# Altium schematic sheet LoRa_Node.SchDoc
size A3
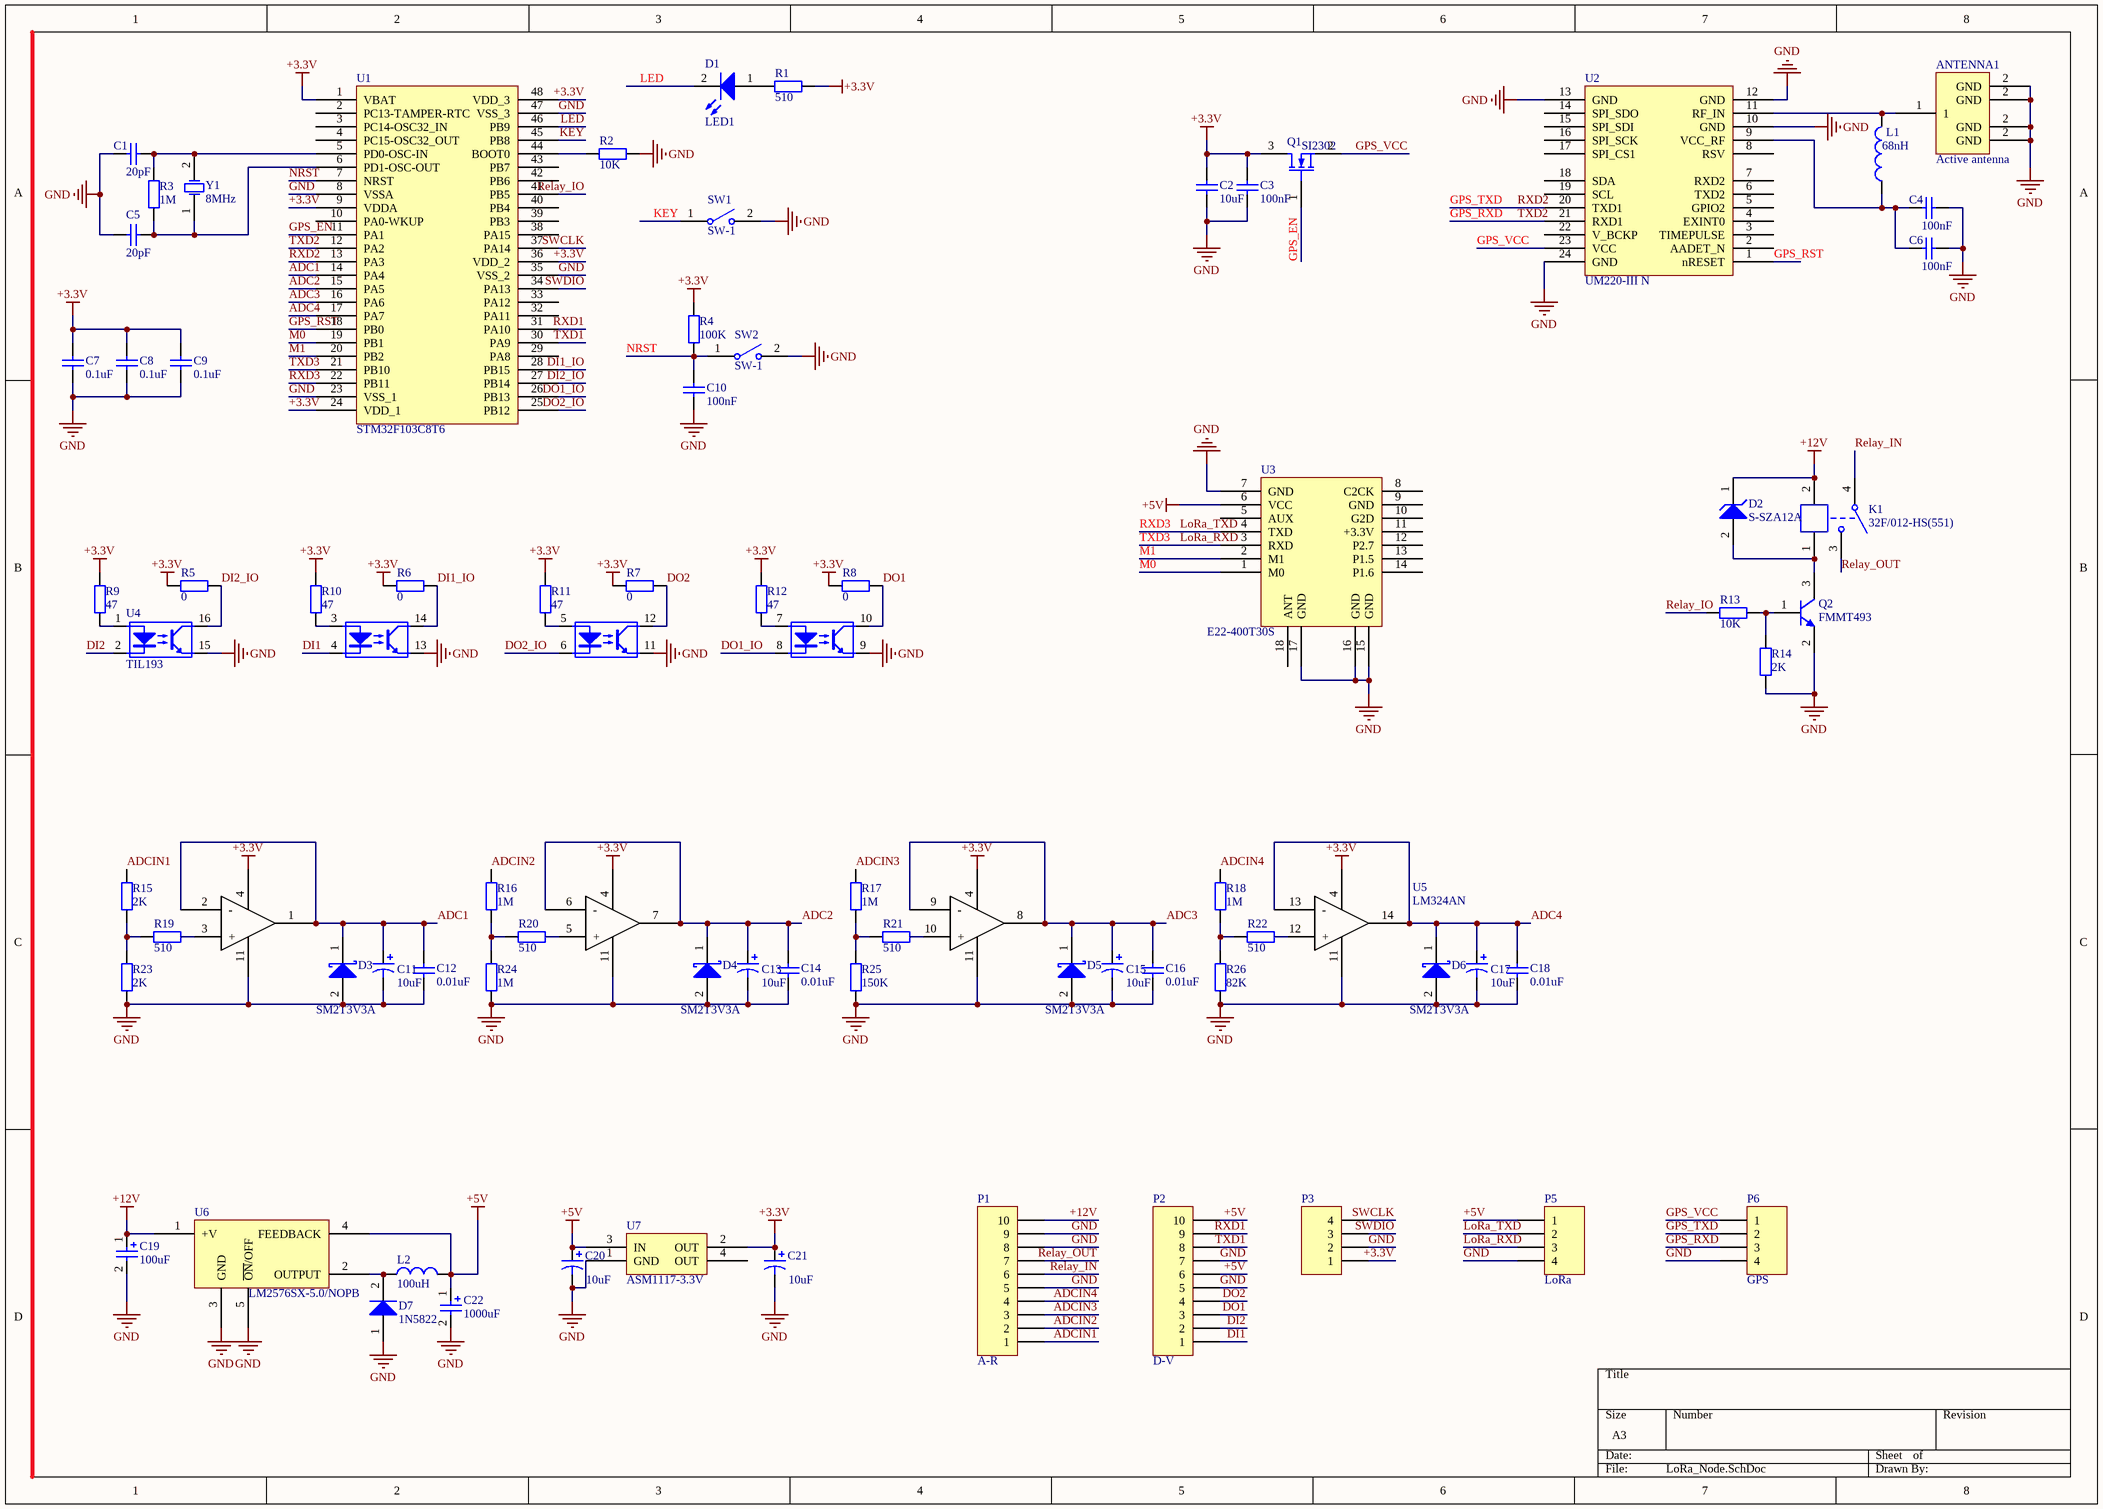
[diagram p0: LoRa_Node.SchDoc]

## Parts
ANTENNA1  Active antenna  [SMA-W]
C1  value 20pF  [0603C]  (hidden comment: Cap8)
C2  value 10uF  [0603C]  (hidden comment: Cap15)
C3  value 100nF  [0603C]  (hidden comment: Cap16)
C4  value 100nF  [0603C]  (hidden comment: Cap17)
C5  value 20pF  [0603C]  (hidden comment: Cap9)
C6  value 100nF  [0603C]  (hidden comment: Cap18)
C7  value 0.1uF  [0603C]  (hidden comment: Cap11)
C8  value 0.1uF  [0603C]  (hidden comment: Cap12)
C9  value 0.1uF  [0603C]  (hidden comment: Cap13)
C10  value 100nF  [0603C]  (hidden comment: Cap10)
C11  value 10uF  [0603C]
C12  value 0.01uF  [0603C]  (hidden comment: Cap)
C13  value 10uF  [0603C]
C14  value 0.01uF  [0603C]  (hidden comment: Cap)
C15  value 10uF  [0603C]
C16  value 0.01uF  [0603C]  (hidden comment: Cap)
C17  value 10uF  [0603C]
C18  value 0.01uF  [0603C]  (hidden comment: Cap)
C19  100uF  [100uF-16V]
C20  value 10uF  [0603C]
C21  value 10uF  [0603C]
C22  1000uF  [1000uF-6.3V]
D1  LED1  [D0603]
D2  S-SZA12A  [S-SZA12A]
D3  SM2T3V3A  [3.3V稳压二极管(LMSZ5226BT1G)]
D4  SM2T3V3A  [3.3V稳压二极管(LMSZ5226BT1G)]
D5  SM2T3V3A  [3.3V稳压二极管(LMSZ5226BT1G)]
D6  SM2T3V3A  [3.3V稳压二极管(LMSZ5226BT1G)]
D7  1N5822  [DO-201AD]
K1  32F/012-HS(551)  [32F/012-HS（551）]
L1  value 68nH  [0603L]  (hidden comment: Inductor3)
L2  value 100uH  [L0805]  (hidden comment: Inductor)
P1  A-R  [HDR2.54-LI-10P]
P2  D-V  [HDR2.54-LI-10P]
P3  Header 4  [HDR2.54-LI-4P]  (value not drawn)
P5  LoRa  [HDR2.54-LI-4P]
P6  GPS  [HDR2.54-LI-4P]
Q1  SI2302  [FMMT493]
Q2  FMMT493  [FMMT493]
R1  value 510  [0603R]  (hidden comment: Res11)
R2  value 10K  [0603R]  (hidden comment: Res9)
R3  value 1M  [0603R]  (hidden comment: Res8)
R4  value 100K  [0603R]  (hidden comment: Res10)
R5  value 0  [0603R]  (hidden comment: Res1)
R6  value 0  [0603R]  (hidden comment: Res1)
R7  value 0  [0603R]  (hidden comment: Res1)
R8  value 0  [0603R]  (hidden comment: Res1)
R9  value 47  [0603R]  (hidden comment: Res1)
R10  value 47  [0603R]  (hidden comment: Res1)
R11  value 47  [0603R]  (hidden comment: Res1)
R12  value 47  [0603R]  (hidden comment: Res1)
R13  value 10K  [0603R]  (hidden comment: Res11)
R14  value 2K  [0603R]  (hidden comment: Res11)
R15  value 2K  [0603R]  (hidden comment: Res1)
R16  value 1M  [0603R]  (hidden comment: Res1)
R17  value 1M  [0603R]  (hidden comment: Res1)
R18  value 1M  [0603R]  (hidden comment: Res1)
R19  value 510  [0603R]  (hidden comment: Res1)
R20  value 510  [0603R]  (hidden comment: Res1)
R21  value 510  [0603R]  (hidden comment: Res1)
R22  value 510  [0603R]  (hidden comment: Res1)
R23  value 2K  [0603R]  (hidden comment: Res1)
R24  value 1M  [0603R]  (hidden comment: Res1)
R25  value 150K  [0603R]  (hidden comment: Res1)
R26  value 82K  [0603R]  (hidden comment: Res1)
SW1  SW-1  [SW-1]
SW2  SW-1  [SW-1]
U1  STM32F103C8T6  [stm32l151c8t6]
U2  UM220-III N  [UM220-III]
U3  E22-400T30S  [PE32(915T30S)]
U4  TIL193  [DIP16]
U5  LM324AN  [LM324AN]
U6  LM2576SX-5.0/NOPB  [LM2576SX-5.0/NOPB]
U7  ASM1117-3.3V  [SOT-223]
Y1  8MHz  [XTAL]

## Nets
+3.3V: C2.1 C3.1 C7.1 C8.1 C9.1 C21.1 P3.1 Q1.3(D) R1.1 R4.2 R5.2 R6.2 R7.2 R8.2 R9.2 R10.2 R11.2 R12.2 U1.1(VBAT) U1.9(VDDA) U1.24(VDD_1) U1.36(VDD_2) U1.48(VDD_3) U5.4 U7.2(OUT)
+5V: C20.1 C22.1 L2.2 P2.6 P2.10 P5.1 U3.6(VCC) U6.4(FEEDBACK) U7.3(IN)
+12V: C19.1 D2.1(K) K1.2 P1.10 U6.1(+V)
GND: ANTENNA1.2(GND) C1.2 C2.2 C3.2 C4.2 C5.2 C6.2 C7.2 C8.2 C9.2 C10.2 C11.2 C12.1 C13.2 C14.1 C15.2 C16.1 C17.2 C18.1 C19.2 C20.2 C21.2 C22.2 D3.2(A) D4.2(A) D5.2(A) D6.2(A) D7.1(+) P1.5 P1.8 P1.9 P2.5 P2.7 P3.2 P5.4 P6.4 Q2.2(E) R2.2 R14.2 R23.1 R24.1 R25.1 R26.1 SW1.2(COMMON) SW2.2(COMMON) U1.8(VSSA) U1.23(VSS_1) U1.35(VSS_2) U1.47(VSS_3) U2.10(GND) U2.12(GND) U2.13(GND) U2.24(GND) U3.7(GND) U3.15(GND) U3.16(GND) U3.17(GND) U4.9(Emitter) U4.11(Emitter) U4.13(Emitter) U4.15(Emitter) U5.11 U6.3(GND) U6.5(~{ON}/OFF) U7.1(GND)
ADC1: C11.1 C12.2 D3.1(K) U1.14(PA4) U5.1 U5.2(-)
ADC2: C13.1 C14.2 D4.1(K) U1.15(PA5) U5.6(-) U5.7
ADC3: C15.1 C16.2 D5.1(K) U1.16(PA6) U5.8 U5.9(-)
ADC4: C17.1 C18.2 D6.1(K) U1.17(PA7) U5.13(-) U5.14
ADCIN1: P1.1 R15.2
ADCIN2: P1.2 R16.2
ADCIN3: P1.3 R17.2
ADCIN4: P1.4 R18.2
DI1: P2.1 U4.4(LED_Cathode)
DI1_IO: R6.1 U1.28(PB15) U4.14(Collector)
DI2: P2.2 U4.2(LED_Cathode)
DI2_IO: R5.1 U1.27(PB14) U4.16(Collector)
DO1: P2.3 R8.1 U4.10(Collector)
DO1_IO: U1.26(PB13) U4.8(LED_Cathode)
DO2: P2.4 R7.1 U4.12(Collector)
DO2_IO: U1.25(PB12) U4.6(LED_Cathode)
GPS_EN: Q1.1(G) U1.11(PA1)
GPS_RST: U1.18(PB0) U2.1(nRESET)
GPS_RXD: P6.3 U1.12(PA2) U2.21(RXD1)  [also labelled TXD2]
GPS_TXD: P6.2 U1.13(PA3) U2.20(TXD1)  [also labelled RXD2]
GPS_VCC: P6.1 Q1.2(S) U2.23(VCC)
KEY: SW1.1(COMMON) U1.45(PB8)
LED: D1.2(K) U1.46(PB9)
LoRa_RXD: P5.3 U1.21(PB10) U3.3(RXD)  [also labelled TXD3]
LoRa_TXD: P5.2 U1.22(PB11) U3.4(TXD)  [also labelled RXD3]
M0: U1.19(PB1) U3.1(M0)
M1: U1.20(PB2) U3.2(M1)
NRST: C10.1 R4.1 SW2.1(COMMON) U1.7(NRST)
Relay_IN: K1.4 P1.6
Relay_IO: R13.2 U1.41(PB5)
Relay_OUT: K1.3 P1.7
RXD1: P2.9 U1.31(PA10)
SWCLK: P3.4 U1.37(PA14)
SWDIO: P3.3 U1.34(PA13)
TXD1: P2.8 U1.30(PA9)
NetANTENNA1_1: ANTENNA1.1 L1.2 U2.11(RF_IN)
NetC1_1: C1.1 R3.2 U1.5(PD0-OSC-IN) Y1.2(OSC2)
NetC4_1: C4.1 C6.1 L1.1 U2.9(VCC_RF)
NetC5_1: C5.1 R3.1 U1.6(PD1-OSC-OUT) Y1.1(OSC1)
NetD1_1: D1.1(A) R1.2
NetD2_2: D2.2(A) K1.1 Q2.3(C)
NetD7_2: D7.2(-) L2.1 U6.2(OUTPUT)
NetQ2_1: Q2.1(B) R13.1 R14.1
NetR2_1: R2.1 U1.44(BOOT0)
NetR9_1: R9.1 U4.1(LED_Anode)
NetR10_1: R10.1 U4.3(LED_Anode)
NetR11_1: R11.1 U4.5(LED_Anode)
NetR12_1: R12.1 U4.7(LED_Anode)
NetR15_1: R15.1 R19.2 R23.2
NetR16_1: R16.1 R20.2 R24.2
NetR17_1: R17.1 R21.2 R25.2
NetR18_1: R18.1 R22.2 R26.2
NetR19_1: R19.1 U5.3(+)
NetR20_1: R20.1 U5.5(+)
NetR21_1: R21.1 U5.10(+)
NetR22_1: R22.1 U5.12(+)

Not connected (* = marked no-connect by the designer): U1 2(PC13-TAMPER-RTC) 3(PC14-OSC32_IN) 4(PC15-OSC32_OUT) 10(PA0-WKUP) 29(PA8) 32(PA11) 33(PA12) 38(PA15) 39(PB3) 40(PB4) 42(PB6) 43(PB7); U2 2(AADET_N) 3(TIMEPULSE) 4(EXINT0) 5(GPIO2) 6(TXD2) 7(RXD2) 8(RSV) 14(SPI_SDO) 15(SPI_SDI) 16(SPI_SCK) 17(SPI_CS1) 18(SDA) 19(SCL) 22(V_BCKP); U3 5(AUX) 8(C2CK) 9(GND) 10(G2D) 11(+3.3V) 12(P2.7) 13(P1.5) 14(P1.6) 18(ANT); U7 4(OUT)

## Library data of the parts
C1-C10 = Cap: Capacitor; Published: 8-Jun-2000; LatestRevisionDate: 17-Jul-2002; LatestRevisionNote: Re-released for DXP Platform.; PackageReference: RAD-0.3; Publisher: Altium Limited; PackageDescription: Radial Cap, Thru-Hole; 2 Leads; 0.3 in Pin Spacing
C11 C13 C15 C17 C20 C21 = Cap Pol1: Polarized Capacitor (Radial); Published: 8-Jun-2000; LatestRevisionDate: 17-Jul-2002; LatestRevisionNote: Re-released for DXP Platform.; PackageReference: RB7.6-15; Publisher: Altium Limited; PackageDescription: Polarized Capacitor (Radial); 2 Leads
C12 C14 C16 C18 = Cap: 无极性电容; Published: 8-Jun-2000; LatestRevisionDate: 17-Jul-2002; LatestRevisionNote: Re-released for DXP Platform.; PackageReference: RAD-0.3; Publisher: Altium Limited
C19 C22 = Cap Pol2: Polarized Capacitor (Axial); Published: 8-Jun-2000; LatestRevisionDate: 17-Jul-2002; LatestRevisionNote: Re-released for DXP Platform.; PackageReference: POLAR0.8; Publisher: Altium Limited; PackageDescription: Polarized Capacitor; 2 Leads
D1 = LED1: Typical RED GaAs LED; Published: 8-Jun-2000; LatestRevisionDate: 08-Jul-2005; LatestRevisionNote: Mech Layer 1 removed.; PackageReference: LED-1; Publisher: Altium Limited; PackageDescription: LED; 2 Leads
D2 = D Zener: Zener Diode; Published: 8-Jun-2000; LatestRevisionDate: 17-Jul-2002; LatestRevisionNote: Re-released for DXP Platform.; PackageReference: DIODE-0.7; Publisher: Altium Limited; PackageDescription: Diode, Thru-Hole; 2 Leads; 0.7 in Pin Spacing
D3-D6 = Diode 10TQ035: Schottky Rectifier; Note: Terminal 2 is the TAB and is electrically connected to the cathode; Published: 8-Jun-2000; LatestRevisionDate: 17-Jul-2002; LatestRevisionNote: Re-released for DXP Platform.; DatasheetVersion: PD-2.057B; PackageVersion: Feb-1998; PackageReference: TO-220AC; Publisher: Altium Limited; PackageDescription: TO, Thru-Hole, Vertical, Heatsink Mounted; 3 In-Line Leads (1 Absent); Pitch 2.54 mm; ComponentLink1Description: Manufacturer Link; ComponentLink1URL: http://www.irf.com/; ComponentLink2Description: Datasheet; ComponentLink2URL: http://www.irf.com/product-info/datasheets/data/10tq.pdf
D7 = Diode 1N5408: 3 Amp Medium Power Silicon Rectifier Diode; Published: 8-Jun-2000; LatestRevisionDate: 17-Jul-2002; LatestRevisionNote: Re-released for DXP Platform.; DatasheetVersion: Aug-1984; PackageReference: DO-201AD; Publisher: Altium Limited; PackageDescription: Diode, Axial; Body 9.5 x 5.3 mm (LxDia. max), Lead Dia. 1.32 mm (max); ComponentLink1Description: Manufacturer Link; ComponentLink1URL: http://www.irf.com/
L1 = Inductor: Code_IEC: 1005; Published: 8-Jun-2000; LatestRevisionDate: 29-May-2009; LatestRevisionNote: IPC-7351 Footprint Added.; PackageReference: 0402-A; Publisher: Altium Limited; PackageDescription: Chip Inductor; Code_JEITA: 0402
L2 = Inductor: 电感; Code_IEC: 1005; Published: 8-Jun-2000; LatestRevisionDate: 17-Jul-2002; LatestRevisionNote: Re-released for DXP Platform.; PackageReference: 0402-A; Publisher: Altium Limited; Code_JEITA: 0402
P1 P2 = MHDR1X10: Header, 10-Pin; LatestRevisionDate: 17-Jul-2002; LatestRevisionNote: Re-released for DXP Platform.; Publisher: Altium Limited
P3 = Header 4: 接插件; LatestRevisionDate: 17-Jul-2002; LatestRevisionNote: Re-released for DXP Platform.; Publisher: Altium Limited
P5 P6 = Header 4: Header, 4-Pin; LatestRevisionDate: 17-Jul-2002; LatestRevisionNote: Re-released for DXP Platform.; Publisher: Altium Limited
Q1 = MOSFET-N: N-Channel MOSFET; Published: 8-Jun-2000; LatestRevisionDate: 17-Jul-2002; LatestRevisionNote: Re-released for DXP Platform.; PackageVersion: 1995/1996; PackageReference: E3; Publisher: Altium Limited; PackageDescription: TO, Flat Index; 3 In-Line, Axial Leads; Body Dia. 4.6mm; Lead Dia. 0.5 mm (max)
Q2 = S8050: NPN三极管; Published: 8-Jun-2000; LatestRevisionDate: 15-Jan-2003; LatestRevisionNote: PCB Footprint 'BCY-W3/D4.7' replaced; DatasheetDocument: 1997; PackageDocument: Sep-1998; PackageReference: TO-92A; Publisher: Altium Limited; Code_JEDEC: TO-92A; ComponentLink1Description: Manufacturer Link; ComponentLink1URL: http://www.fairchildsemi.com/; ComponentLink2Description: Datasheet; ComponentLink2URL: http://www.fairchildsemi.com/ds/2N%2F2N3904.pdf
R1-R4 R13 R14 = Res2: Resistor; Published: 8-Jun-2000; LatestRevisionDate: 17-Jul-2002; LatestRevisionNote: Re-released for DXP Platform.; PackageReference: AXIAL-0.4; Publisher: Altium Limited; PackageDescription: Axial Device, Thru-Hole; 2 Leads; 0.4 in Pin Spacing
R5-R12 R15-R26 = Res1: 贴片电阻; Published: 8-Jun-2000; LatestRevisionDate: 17-Jul-2002; LatestRevisionNote: Re-released for DXP Platform.; PackageReference: AXIAL-0.4; Publisher: Altium Limited
U4 = TIL93
U7 = ASM1117: 3.3V稳压芯片
Y1 = XTAL: Crystal Oscillator; Published: 8-Jun-2000; LatestRevisionDate: 17-Jul-2002; LatestRevisionNote: Re-released for DXP Platform.; PackageReference: R38; Publisher: Altium Limited; PackageDescription: Crystal, Thru-Hole; 2 Leads; Body 3.1 x 8.2 mm (Dia.xH)